# EasyEDA schematic SCH_tactile cube.json
TITLE: Sheet_1; REV: 1.0; Date: 2021-01-26; Sheet: 1/1; Drawn By: Kyuuketsu92; Company: Your Company
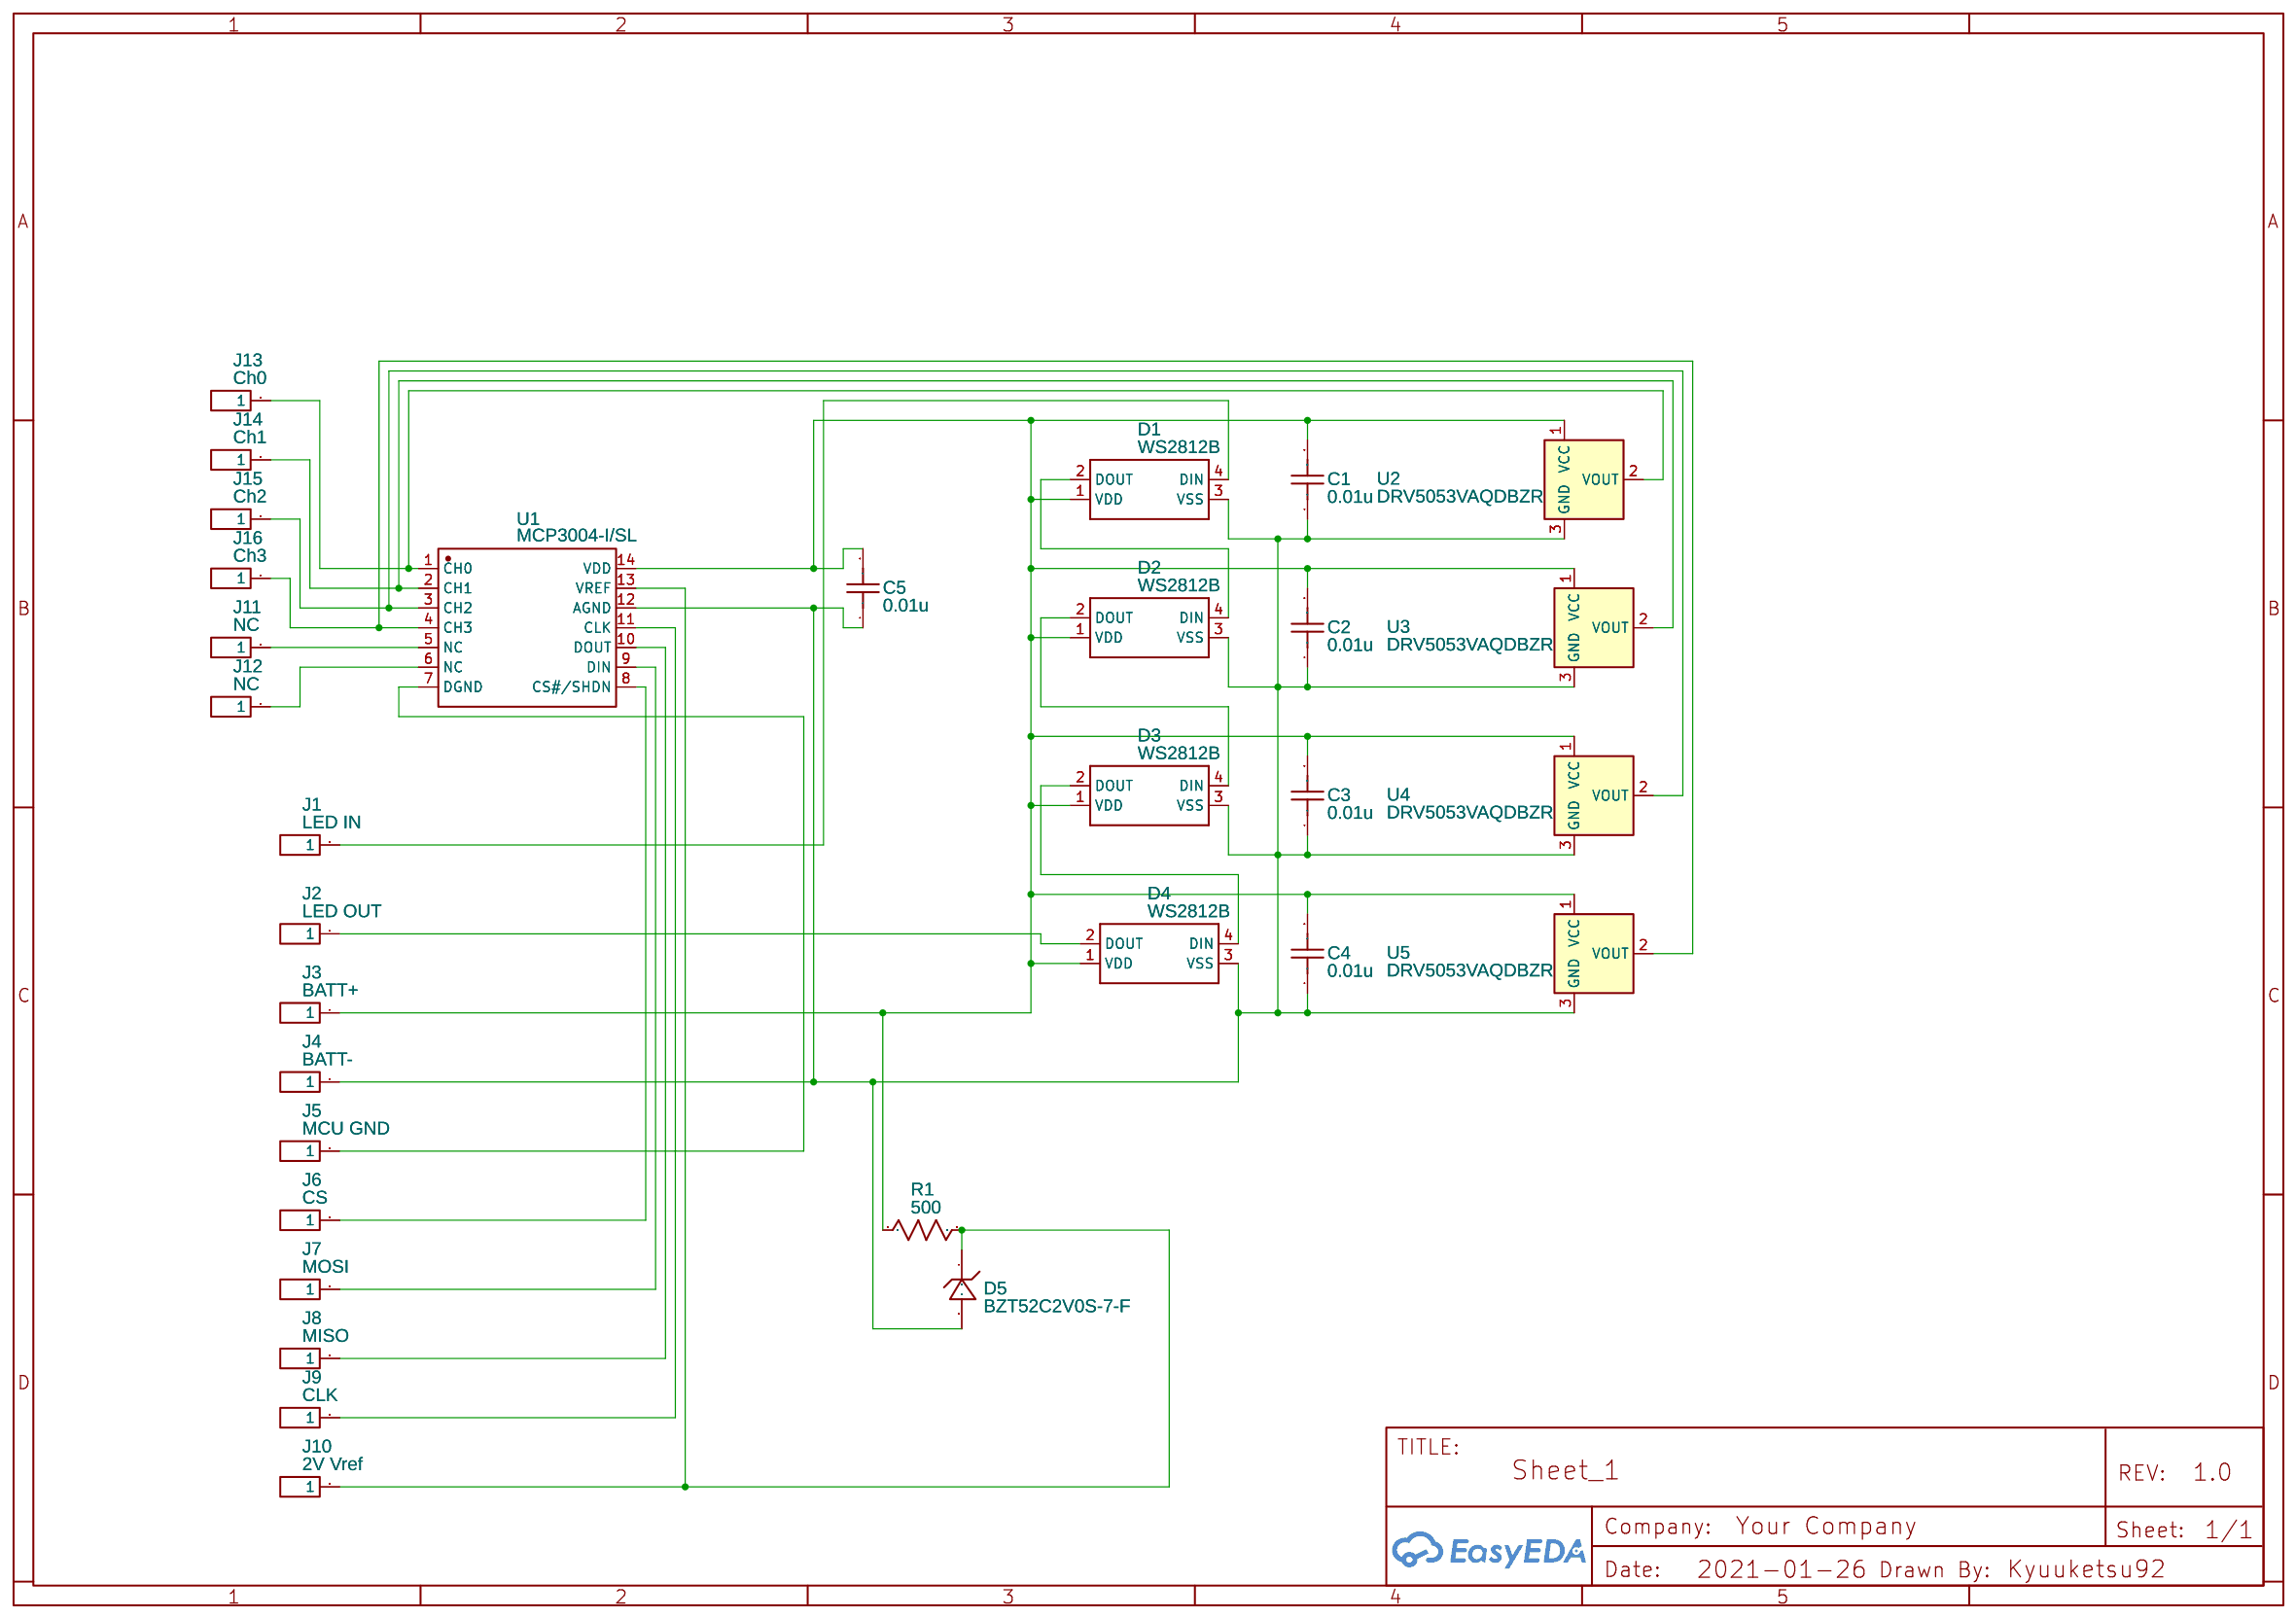
[diagram p0: schematic sheet]

## Parts
C1  0.01u  [C0603]
C2  0.01u  [C0603]
C3  0.01u  [C0603]
C4  0.01u  [C0603]
C5  0.01u  [C0603]
D1  WS2812B  [WS2812B]
D2  WS2812B  [WS2812B]
D3  WS2812B  [WS2812B]
D4  WS2812B  [WS2812B]
D5  BZT52C2V0S-7-F  [SOD-323_L1.8-W1.3-LS2.5-RD]
J1  LED IN  [HDR-M-2.54_1X1]
J2  LED OUT  [HDR-M-2.54_1X1]
J3  BATT+  [HDR-M-2.54_1X1]
J4  BATT-  [HDR-M-2.54_1X1]
J5  MCU GND  [HDR-M-2.54_1X1]
J6  CS  [HDR-M-2.54_1X1]
J7  MOSI  [HDR-M-2.54_1X1]
J8  MISO  [HDR-M-2.54_1X1]
J9  CLK  [HDR-M-2.54_1X1]
J10  2V Vref  [HDR-M-2.54_1X1]
J11  NC  [HDR-M-2.54_1X1]
J12  NC  [HDR-M-2.54_1X1]
J13  Ch0  [HDR-M-2.54_1X1]
J14  Ch1  [HDR-M-2.54_1X1]
J15  Ch2  [HDR-M-2.54_1X1]
J16  Ch3  [HDR-M-2.54_1X1]
R1  500  [R0603]
U1  MCP3004-I/SL  [SOIC-14_L8.7-W3.9-P1.27-LS6.0-BL]
U2  DRV5053VAQDBZR  [SOT-23-3]
U3  DRV5053VAQDBZR  [SOT-23-3]
U4  DRV5053VAQDBZR  [SOT-23-3]
U5  DRV5053VAQDBZR  [SOT-23-3]

## Library data of the parts
C1-C5 = C_0603_US: Contributor: LCEDA_Lib
D1-D4 = WS2812B: Contributor: SparkFun
D5 = BZT52C2V0S-7-F: Supplier: LCSC; Supplier Part: C87969; Manufacturer: Diodes Incorporated; Contributor: LCSC
J1-J16 = HDR-M-2.54_1x1: Supplier Part: C81276; Supplier: LCSC; Contributor: LCEDA_Lib
R1 = R_0603_US: Contributor: LCEDA_Lib
U1 = MCP3004-I/SL: Supplier: LCSC; Supplier Part: C512186; Manufacturer: Microchip Tech; Contributor: LCSC; SMT Type: Extend; JLCPCB SMD: Yes; LCSC Assembly: Yes
U2-U5 = DRV5053VAQDBZR: Manufacturer: Texas Instruments; Contributor: morlan.lunsford

## Nets
Net-(C1-1): C1.1 C2.1 C3.1 C4.1 C5.1 D1.3(VSS) D2.3(VSS) D3.3(VSS) D4.3(VSS) D5.2(A) J4.1 U1.12(AGND) U2.3(GND) U3.3(GND) U4.3(GND) U5.3(GND)
Net-(C1-2): C1.2 C2.2 C3.2 C4.2 C5.2 D1.1(VDD) D2.1(VDD) D3.1(VDD) D4.1(VDD) J3.1 R1.1 U1.14(VDD) U2.1(VCC) U3.1(VCC) U4.1(VCC) U5.1(VCC)
Net-(D1-2): D1.2(DOUT) D2.4(DIN)
Net-(D1-4): D1.4(DIN) J1.1
Net-(D2-2): D2.2(DOUT) D3.4(DIN)
Net-(D3-2): D3.2(DOUT) D4.4(DIN)
Net-(D4-2): D4.2(DOUT) J2.1
Net-(D5-1): D5.1(C) J10.1 R1.2 U1.13(VREF)
Net-(J5-1): J5.1 U1.7(DGND)
Net-(J6-1): J6.1 U1.8(CS#/SHDN)
Net-(J7-1): J7.1 U1.9(DIN)
Net-(J8-1): J8.1 U1.10(DOUT)
Net-(J9-1): J9.1 U1.11(CLK)
Net-(J11-1): J11.1 U1.5(NC)
Net-(J12-1): J12.1 U1.6(NC)
Net-(J13-1): J13.1 U1.1(CH0) U2.2(VOUT)
Net-(J14-1): J14.1 U1.2(CH1) U3.2(VOUT)
Net-(J15-1): J15.1 U1.3(CH2) U4.2(VOUT)
Net-(J16-1): J16.1 U1.4(CH3) U5.2(VOUT)
